# Altium schematic sheet Audiocodec.SchDoc: Audiocodec
size A3; DocumentNumber: 3; SheetNumber: 3
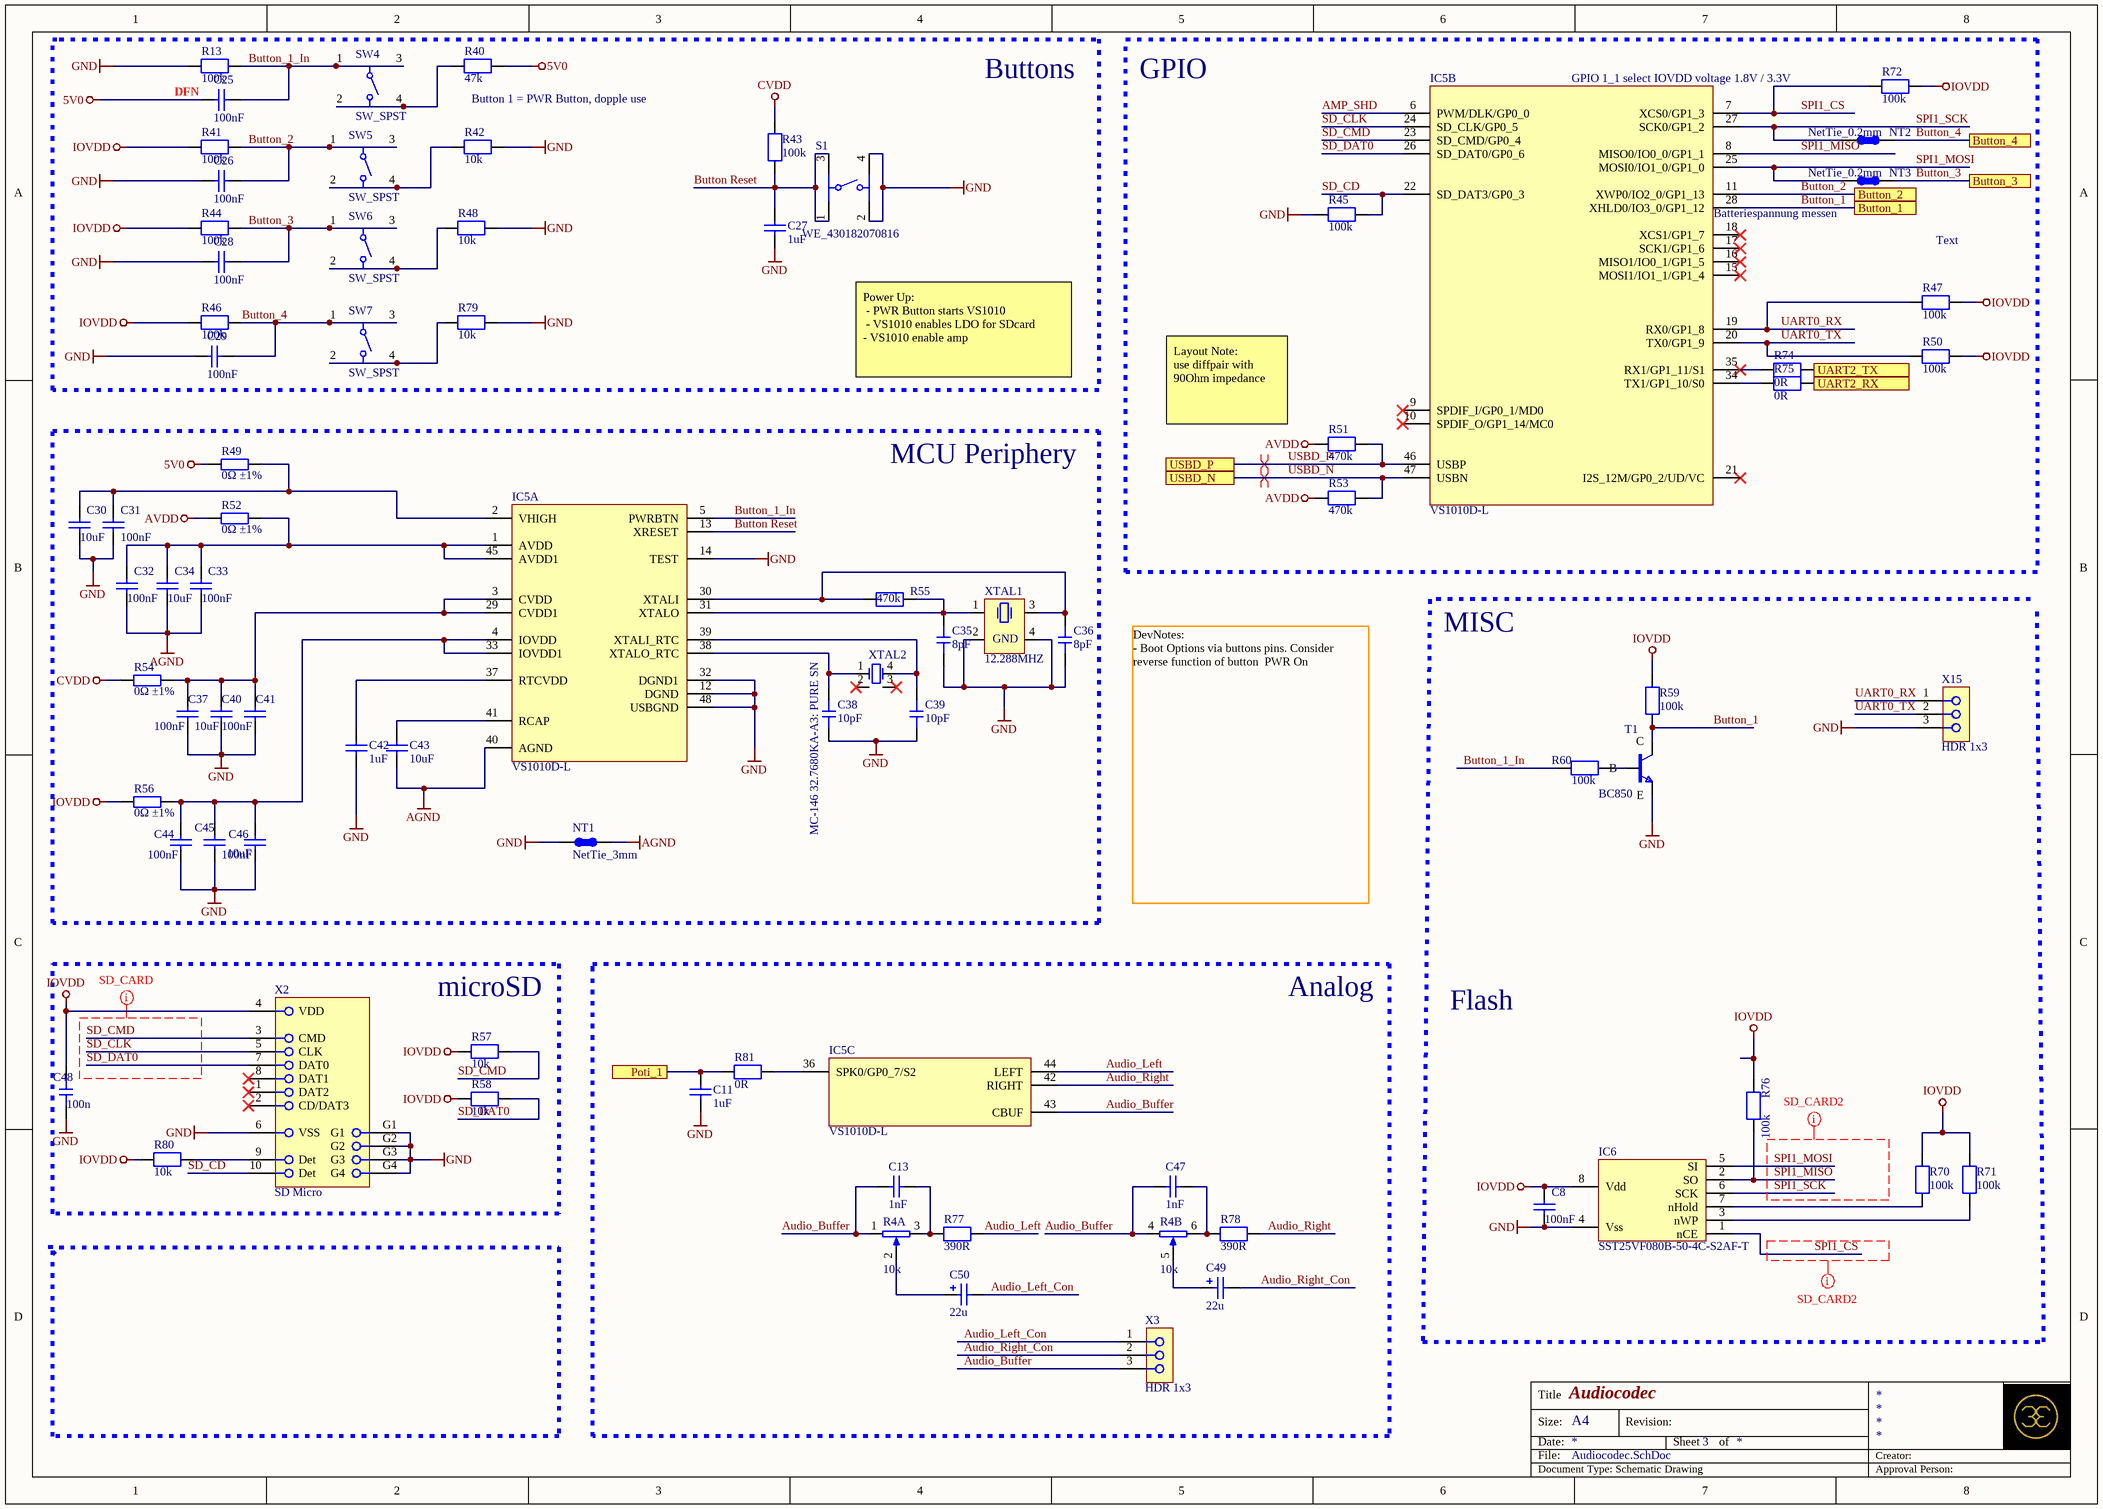
[diagram p0: Audiocodec.SchDoc]

## Parts
C8  100nF  [CAPC1608X95N]
C11  1uF  [CAPC2012X145N]
C13  1nF  [CAPC2012X145N]
C25  100nF  [CAPC1608X95N]
C26  100nF  [CAPC1608X95N]
C27  1uF  [CAPC2012X145N]
C28  100nF  [CAPC1608X95N]
C29  100nF  [CAPC1608X95N]
C30  10uF  [CAPC2012X145N]
C31  100nF  [CAPC1608X95N]
C32  100nF  [CAPC1608X95N]
C33  100nF  [CAPC1608X95N]
C34  10uF  [CAPC2012X145N]
C35  8pF  [CAPC1005X55]
C36  8pF  [CAPC1005X55]
C37  100nF  [CAPC1608X95N]
C38  10pF  [CAPC1005X55]
C39  10pF  [CAPC1005X55]
C40  10uF  [CAPC2012X145N]
C41  100nF  [CAPC1608X95N]
C42  1uF  [CAPC2012X145N]
C43  10uF  [CAPC2012X145N]
C44  100nF  [CAPC1608X95N]
C45  10uF  [CAPC2012X145N]
C46  100nF  [CAPC1608X95N]
C47  1nF  [CAPC2012X145N]
C48  100n  [CAPC1005X55]
C49  22u  [CAPAE4643X54M]
C50  22u  [CAPAE4643X54M]
IC5  VS1010D-L  [TSQFP50P900X900X160-48N]  (parts A,B,C of 3)
IC6  SST25VF080B-50-4C-S2AF-T  [SOIC127P790X216-8N]
NT1  NetTie_3mm  [NET_TIE_3MM]  (net tie, no BOM)
NT2  NetTie_0.2mm  [NET_TIE_0.2MM]  (net tie, no BOM)
NT3  NetTie_0.2mm  [NET_TIE_0.2MM]  (net tie, no BOM)
R4  10k  [rk12l123]  (parts A,B of 2)
R13  100k  [RESC2012X70N]
R40  47k  [RESC2012X70N]
R41  100k  [RESC2012X70N]
R42  10k  [RESC2012X70N]
R43  100k  [RESC2012X70N]
R44  100k  [RESC2012X70N]
R45  100k  [RESC2012X70N]
R46  100k  [RESC2012X70N]
R47  100k  [RESC2012X70N]
R48  10k  [RESC2012X70N]
R49  0Ω ±1%  [RESC2012X70N]
R50  100k  [RESC2012X70N]
R51  470k  [RESC2012X70N]
R52  0Ω ±1%  [RESC2012X70N]
R53  470k  [RESC2012X70N]
R54  0Ω ±1%  [RESC2012X70N]
R55  470k  [RESC2012X70N]
R56  0Ω ±1%  [RESC2012X70N]
R57  10k  [RESC2012X70N]
R58  10k  [RESC2012X70N]
R59  100k  [RESC1608X55N]
R60  100k  [RESC1608X55N]
R70  100k  [RESC2012X70N]
R71  100k  [RESC2012X70N]
R72  100k  [RESC2012X70N]
R74  0R  [RESC1608X55N]
R75  0R  [RESC1608X55N]
R76  100k  [RESC2012X70N]
R77  390R  [RESC2012X70N]
R78  390R  [RESC2012X70N]
R79  10k  [RESC2012X70N]
R80  10k  [RESC2012X70N]
R81  0R  [RESC1608X55N]
S1  WE_430182070816  [430182070816]
SW4  SW_SPST  [TL1105D]
SW5  SW_SPST  [TL1105D]
SW6  SW_SPST  [TL1105D]
SW7  SW_SPST  [TL1105D]
T1  BC850  [SOT95P280X135-3N_BEC]
X2  SD Micro  [MOLEX_104031-0811]
X3  HDR 1x3  [CON_HEADER2.54_1x3W]
X15  HDR 1x3  [CON_HEADER2.54_1x3W]
XTAL1  12.288MHZ  [XTAL_ECS-122.8-10-33-AGL-TR]
XTAL2  MC-146 32.7680KA-A3: PURE SN  [Epson_MC-146]

## Blocks framed on the sheet
Buttons: C25-C29 R13 R40-R44 R46 R48 R79 S1 SW4-SW7
GPIO: IC5 NT2 NT3 R45 R47 R50 R51 R53 R72 R74 R75
MCU Periphery: C30-C46 IC5 NT1 R49 R52 R54-R56 XTAL1 XTAL2
microSD: C48 R57 R58 R80 X2

## Ports
Button_1, Button_2, Button_3, Button_4, Poti_1, UART2_RX, UART2_TX, USBD_N, USBD_P

## Nets
5V0: C25.2 R40.2 R49.1
AGND: C32.1 C33.1 C34.1 C43.1 IC5.40(AGND) NT1.1
AVDD: R51.1 R52.1 R53.1
CVDD: R43.2 R54.1
GND: C8.1 C11.1 C26.2 C27.1 C28.2 C29.2 C30.1 C31.1 C35.1 C36.1 C37.1 C38.1 C39.1 C40.1 C41.1 C42.1 C44.1 C45.1 C46.1 C48.2 IC5.12(DGND) IC5.14(TEST) IC5.32(DGND1) IC5.48(USBGND) IC6.4(Vss) NT1.2 R13.1 R42.2 R45.2 R48.2 R79.2 S1.2 S1.4 T1.E X2.6(VSS) X2.G1 X2.G2 X2.G3 X2.G4 X15.3 XTAL1.2(nc) XTAL1.4(NC)
IOVDD: C8.2 C48.1 IC6.8(Vdd) R41.1 R44.1 R46.1 R47.2 R50.2 R56.1 R57.1 R58.1 R59.1 R70.2 R71.2 R72.2 R76.2 R80.1 X2.4(VDD)
AMP_SHD: IC5.6(PWM/DLK/GP0_0)
Audio_Buffer: C13.1 C47.1 IC5.43(CBUF) R4.1 R4.4 X3.3
Audio_Left: IC5.44(LEFT) R77.2
Audio_Left_Con: C50.2 X3.1
Audio_Right: IC5.42(RIGHT) R78.2
Audio_Right_Con: C49.2 X3.2
Button Reset: C27.2 IC5.13(XRESET) R43.1 S1.1 S1.3
Button_1: IC5.28(XHLD0/IO3_0/GP1_12) R59.2 T1.C ; port Button_1
Button_1_In: C25.1 IC5.5(PWRBTN) R13.2 R60.2 SW4.1 SW4.3
Button_2: C26.1 IC5.11(XWP0/IO2_0/GP1_13) R41.2 SW5.1 SW5.3 ; port Button_2
Button_3: C28.1 NT3.1 R44.2 SW6.1 SW6.3 ; port Button_3
Button_4: C29.1 NT2.1 R46.2 SW7.1 SW7.3 ; port Button_4
Poti_1: C11.2 R81.1 ; port Poti_1
SD_CD: IC5.22(SD_DAT3/GP0_3) R45.1 X2.10(Det)
SD_CLK: IC5.24(SD_CLK/GP0_5) X2.5(CLK)
SD_CMD: IC5.23(SD_CMD/GP0_4) R57.2 X2.3(CMD)
SD_DAT0: IC5.26(SD_DAT0/GP0_6) R58.2 X2.7(DAT0)
SPI1_CS: IC5.7(XCS0/GP1_3) IC6.1(nCE) R72.1
SPI1_MISO: IC5.8(MISO0/IO0_0/GP1_1) IC6.2(SO) R76.1
SPI1_MOSI: IC5.25(MOSI0/IO1_0/GP1_0) IC6.5(SI) NT3.2
SPI1_SCK: IC5.27(SCK0/GP1_2) IC6.6(SCK) NT2.2
UART0_RX: IC5.19(RX0/GP1_8) R47.1 X15.1
UART0_TX: IC5.20(TX0/GP1_9) R50.1 X15.2
UART2_RX: R75.2 ; port UART2_RX
UART2_TX: R74.2 ; port UART2_TX
USBD_N: IC5.47(USBN) R53.2 ; port USBD_N
USBD_P: IC5.46(USBP) R51.2 ; port USBD_P
NetC13_2: C13.2 R4.3 R77.1
NetC30_2: C30.2 C31.2 IC5.2(VHIGH) R49.2
NetC32_2: C32.2 C33.2 C34.2 IC5.1(AVDD) IC5.45(AVDD1) R52.2
NetC35_2: C35.2 IC5.31(XTALO) R55.2 XTAL1.1(OSC1)
NetC36_2: C36.2 IC5.30(XTALI) R55.1 XTAL1.3(OSC2)
NetC37_2: C37.2 C40.2 C41.2 IC5.3(CVDD) IC5.29(CVDD1) R54.2
NetC38_2: C38.2 IC5.38(XTALO_RTC) XTAL2.1(OSC1)
NetC39_2: C39.2 IC5.39(XTALI_RTC) XTAL2.4(OSC2)
NetC42_2: C42.2 IC5.37(RTCVDD)
NetC43_2: C43.2 IC5.41(RCAP)
NetC44_2: C44.2 C45.2 C46.2 IC5.4(IOVDD) IC5.33(IOVDD1) R56.2
NetC47_2: C47.2 R4.6 R78.1
NetC49_1: C49.1 R4.5
NetC50_1: C50.1 R4.2
NetIC5_34: IC5.34(TX1/GP1_10/S0) R75.1
NetIC5_35: IC5.35(RX1/GP1_11/S1) R74.1
NetIC5_36: IC5.36(SPK0/GP0_7/S2) R81.2
NetIC6_3: IC6.3(nWP) R71.1
NetIC6_7: IC6.7(nHold) R70.1
NetR40_1: R40.1 SW4.2 SW4.4
NetR42_1: R42.1 SW5.2 SW5.4
NetR48_1: R48.1 SW6.2 SW6.4
NetR60_1: R60.1 T1.B
NetR79_1: R79.1 SW7.2 SW7.4
NetR80_2: R80.2 X2.9(Det)

Not connected (* = marked no-connect by the designer): IC5 9(SPDIF_I/GP0_1/MD0)* 10(SPDIF_O/GP1_14/MC0)* 15(MOSI1/IO1_1/GP1_4)* 16(MISO1/IO0_1/GP1_5)* 17(SCK1/GP1_6)* 18(XCS1/GP1_7)* 21(I2S_12M/GP0_2/UD/VC)*; X2 1(DAT2)* 2(CD/DAT3)* 8(DAT1)*; XTAL2 2(nc)* 3(NC)*

## Layout directives
differential pair; net class USB; differential pair class USB_Line; rule Differential Pairs Routing [Pref Gap = 0.15mm    Min Gap  = 0.15mm    Max Gap  = 0.15mmPref Width = 0.5mm    Min Width  = 0.15mm    Max Width  = 0.5mm]: USBD_N, USBD_P
net class SD_CARD; rule Matched Net Lengths [Tolerance = 0.5mm]: SD_CLK, SD_CMD, SD_DAT0
net class SD_CARD2; rule Matched Net Lengths [Tolerance = 0.5mm]: SPI1_CS, SPI1_MISO, SPI1_MOSI, SPI1_SCK

## Notes on the sheet
- DFN
- Button 1 = PWR Button, dopple use
- (near IC5) GPIO 1_1 select IOVDD voltage 1.8V / 3.3V
- (near IC5) Batteriespannung messen
- Text
- Power Up:
  - PWR Button starts VS1010
  - VS1010 enables LDO for SDcard
  - VS1010 enable amp
- (near R51) Layout Note:
  use diffpair with 90Ohm impedance
- MISC
- DevNotes:
  - Boot Options via buttons pins. Consider reverse function of button  PWR On
- Analog
- Flash
- Title
- Size:
- Date:
- File:
- A4
- Revision:
- Sheet
- of
- Creator:
- Document Type: Schematic Drawing
- Approval Person:
- (in symbol XTAL_ECS-122.8-10-33-AGL-TR) GND

## Library data of the parts
C8 C25 C26 C28 C29 C31-C33 C37 C41 C44 C46 = CAP_100nF_0603: Multilayer Ceramic Capacitors MLCC - SMD/SMT, 100nF; Manufacturer: YAGEO; Manufacturer Part Number: CC0603KRX7R9BB104; Voltage Rating: 50VDC; Tolerance: 10%; Alternatives allowed: yes; JLC: C14663
C11 C27 C42 = CAP_1uF_0805: Multilayer Ceramic Capacitors MLCC - SMD/SMT, 1uF; Manufacturer: Samsung Electro-Mechanics; Manufacturer Part Number: CL21B105KBFNNNE; Voltage Rating: 50V; Tolerance: 10%; Alternatives allowed: yes; JLC: C28323
C13 C47 = CAP_1nF_630V: Multilayer Ceramic Capacitors MLCC - SMD/SMT - SMD/SMT, C0G(NP0), 1nF; Manufacturer: Murata Electronics; Manufacturer Part Number: GRM21B5C2J102JWA3L; Voltage Rating: 630VDC; Tolerance: 5%; Alternatives allowed: yes
C30 C34 C40 C43 C45 = CAP_10uF_0805: Multilayer Ceramic Capacitors MLCC - SMD/SMT, 10uF; Manufacturer: Samsung Electro-Mechanics; Manufacturer Part Number: CL21A106KAYNNNE; Voltage Rating: 25V; Tolerance: 10%; Alternatives allowed: yes; JLC: C15850
C35 C36 = CAP_8p_25V_0402: Multilayer Ceramic Capacitors MLCC - SMD/SMT 01005 25VDC 8pF Tol 0.1pF C0G; Manufacturer: Taiyo Yuden; Manufacturer Part Number: TMK042CG080BD-W; Voltage Rating: 25V; Alternatives allowed: YES; Notes: C0G, 0402
C38 C39 = CAP_10p_25V_0402: Multilayer Ceramic Capacitors MLCC - SMD/SMT 01005 25VDC 10pF Tol 0.5pF C0G; Manufacturer: Taiyo Yuden; Manufacturer Part Number: TMK042CG100DD-W; Voltage Rating: 25V; Alternatives allowed: YES; Notes: C0G, 0402
C48 = 100n_50V_0402: MLCC - SMD/SMT 100nF 50Volts 10%; Manufacturer: Yageo; Manufacturer Part Number: CC0402KRX5R9BB104; Voltage Rating: 50V; Tolerance: +-10%; Alternatives allowed: YES; Notes: X5R, 0402; Value: 100nF
C49 C50 = CAP_22u: Aluminium Electrolytic Capacitors - SMD 22UF 16V HA SMD; Manufacturer: Panasonic; Manufacturer Part Number: EEE-HAC220WAR; Tolerance: 20%; Alternatives allowed: NO; Voltage Rating: 16V
IC5 = IC_VS1010D-L: DSP audio microcontroller, QFP-48; Manufacturer: VLSI; Manufacturer Part Number: VS1010D-Q; Alternatives allowed: NO
IC6 = IC_SST25VF080B-50-4C-S2AF-T: NOR Flash 8M (1Mx8) 50MHz 2.7-3.6V Commercial; Manufacturer: Microchip Technology; Alternatives allowed: NO; Manufacturer Part Number: SST25VF080B-50-4C-S2AF-T
NT1 = NetTie_3mm: 3mm NetTie; Notes: PCB connection only
NT2 NT3 = NetTie_0.2mm: 0.2mmmm NetTie; Notes: PCB connection only
R4 = POT_10k_lin_dual_12mm_flat: Potentiometers 12MM V/ADJ ; 10KoHM; Manufacturer: Alps Alpine; Manufacturer Part Number: RK12L123000G; Tolerance: 20%
R13 R41 R43-R47 R50 R70-R72 R76 = RES_100k_0805: Thick Film Resistors - SMD 1/8watt 100Kohms 1% 100ppm; Manufacturer: Vishay / Dale; Manufacturer Part Number: CRCW0805100KFKEA; Voltage Rating: 150V; Alternatives allowed: YES; Tolerance: 1%; JLC: C17407
R40 = RES_47k_0805: Thick Film Resistors - SMD 1/8watt 47Kohms 1%; Manufacturer: Vishay / Dale; Manufacturer Part Number: CRCW080547K0FKEB; Voltage Rating: 150V; Alternatives allowed: YES; Tolerance: 1%; JLC: C17713
R42 R48 R57 R58 R79 R80 = RES_10k_0805: Thick Film Resistors - SMD 1/8watt 10Kohms 1% 100ppm; Manufacturer: Vishay / Dale; Manufacturer Part Number: CRCW080510K0FKEA; Voltage Rating: 150V; Alternatives allowed: YES; Tolerance: 1%; JLC: C17414
R49 R52 R54 R56 = 0805 0R (0R0) 1%: Chip resistor; Manufacturer Part Number: CRCW08050000Z0EAC; Manufacturer: Vishay / Dale; Alternatives allowed: YES; JLC: C17477; Tolerance: 1%
R51 R53 R55 = RES_470k_0805: Thick Film Resistors - SMD 1/8Watt 470Kohms 1% Commercial Use; Manufacturer: Vishay / Dale; Manufacturer Part Number: CRCW0805470KFKEAC; Voltage Rating: 150V; Alternatives allowed: YES; Tolerance: 1%; JLC: C17709
R59 R60 = RES_100k_0603: Thick Film Resistors - SMD 1/10Watt 100Kohms 1% Commercial Use; Manufacturer: Vishay; Manufacturer Part Number: CRCW0603100KFKEAC; Voltage Rating: 75V; Alternatives allowed: YES; Tolerance: 1%
R74 R75 R81 = RES_0R_0603: Thick Film Resistors - SMD 1/10watt ZEROohm Jumper; Manufacturer: Vishay; Manufacturer Part Number: CRCW06030000Z0EA; Voltage Rating: 75V; Tolerance: 1%; Alternatives allowed: YES
R77 R78 = RES_390R_0805: Thick Film Resistors - SMD 1/8Watt 390ohms 1% Commercial Use; Manufacturer: Vishay / Dale; Manufacturer Part Number: CRCW0805390RFKEA; Voltage Rating: 150V; Alternatives allowed: YES; Tolerance: 1%; JLC: C17655
S1 = WE_430182070816: WS-TASV SMT Tact Switch 6x6mm, height 7mm, 160gf; Rated Voltage: 12VDC; Rated Current: 50mA; Washable: No; ComponentLink1Description: Manufacturer; ComponentLink1URL: http://www.we-online.de; ComponentLink2Description: Datasheet; ComponentLink2URL: https://katalog.we-online.com/em/datasheet/430182070816.pdf; Operating Temperature: -40 to +85degC; Part Number: 430182070816; Published Date: September 2019; Contact Material: Stainless Steel; Height: 7mm; Mounting Technology: SMT; Contact Plating: Silver; Operation Force: 160gf; Packaging: Tape and Reel; Terminal Material: Copper Alloy; Publisher: Wurth Elektronik; Terminal Plating: Silver
SW4-SW7 = SW_ TL1105DF160Q: Tastschalter SPST-Schließer Von oben betätigt Durchkontaktierung; Manufacturer: E-Switch; Alternatives allowed: NO; Manufacturer Part Number: TL1105DF160Q
T1 = T_BC850CLT1G: Bipolarer Einzeltransistor (BJT), NPN, 30 V, 100 MHz, 225 mW, 100 mA, 110 hFE; Manufacturer: ON SEMICONDUCTOR; Voltage Rating: 45V; Alternatives allowed: NO; Manufacturer Part Number: BC850CLT1G
X2 = Molex_104031-0811: Memory Card Connectors MICRO SD PUSH-PULL SMT 1.42MM HEIGHT; Manufacturer: Molex; Alternatives allowed: NO; Manufacturer Part Number: 104031-0811
X3 X15 = CON_HEADER_1X3: Board-to-Board-Steckverbinder, 2.54 mm, 3 Kontakt(e), Stiftleiste 1-Reihig; Manufacturer: Samtec; Manufacturer Part Number: TSW-103-07-T-S; Alternatives allowed: YES
XTAL1 = XTAL_ECS-122.8-10-33-AGL-TR: Crystals 12.288MHz 25ppm 10pF -10C +70C; Manufacturer: ECS; Alternatives allowed: NO; Manufacturer Part Number: ECS-122.8-10-33-AGL-TR
XTAL2 = XTAL_MC-146 32.7680KA-A3: PURE SN: Crystals 32.768KHz 9pF 20ppm -40c +85C; Manufacturer: Epson; Manufacturer Part Number: MC-146 32.768KA-AC3:ROHS; Alternatives allowed: NO; Supplier 1: Mouser; Supplier Part Number 1: 732-MC14632.76KAAC3R